# EAGLE design ledclock (EAGLE 9.5.2)
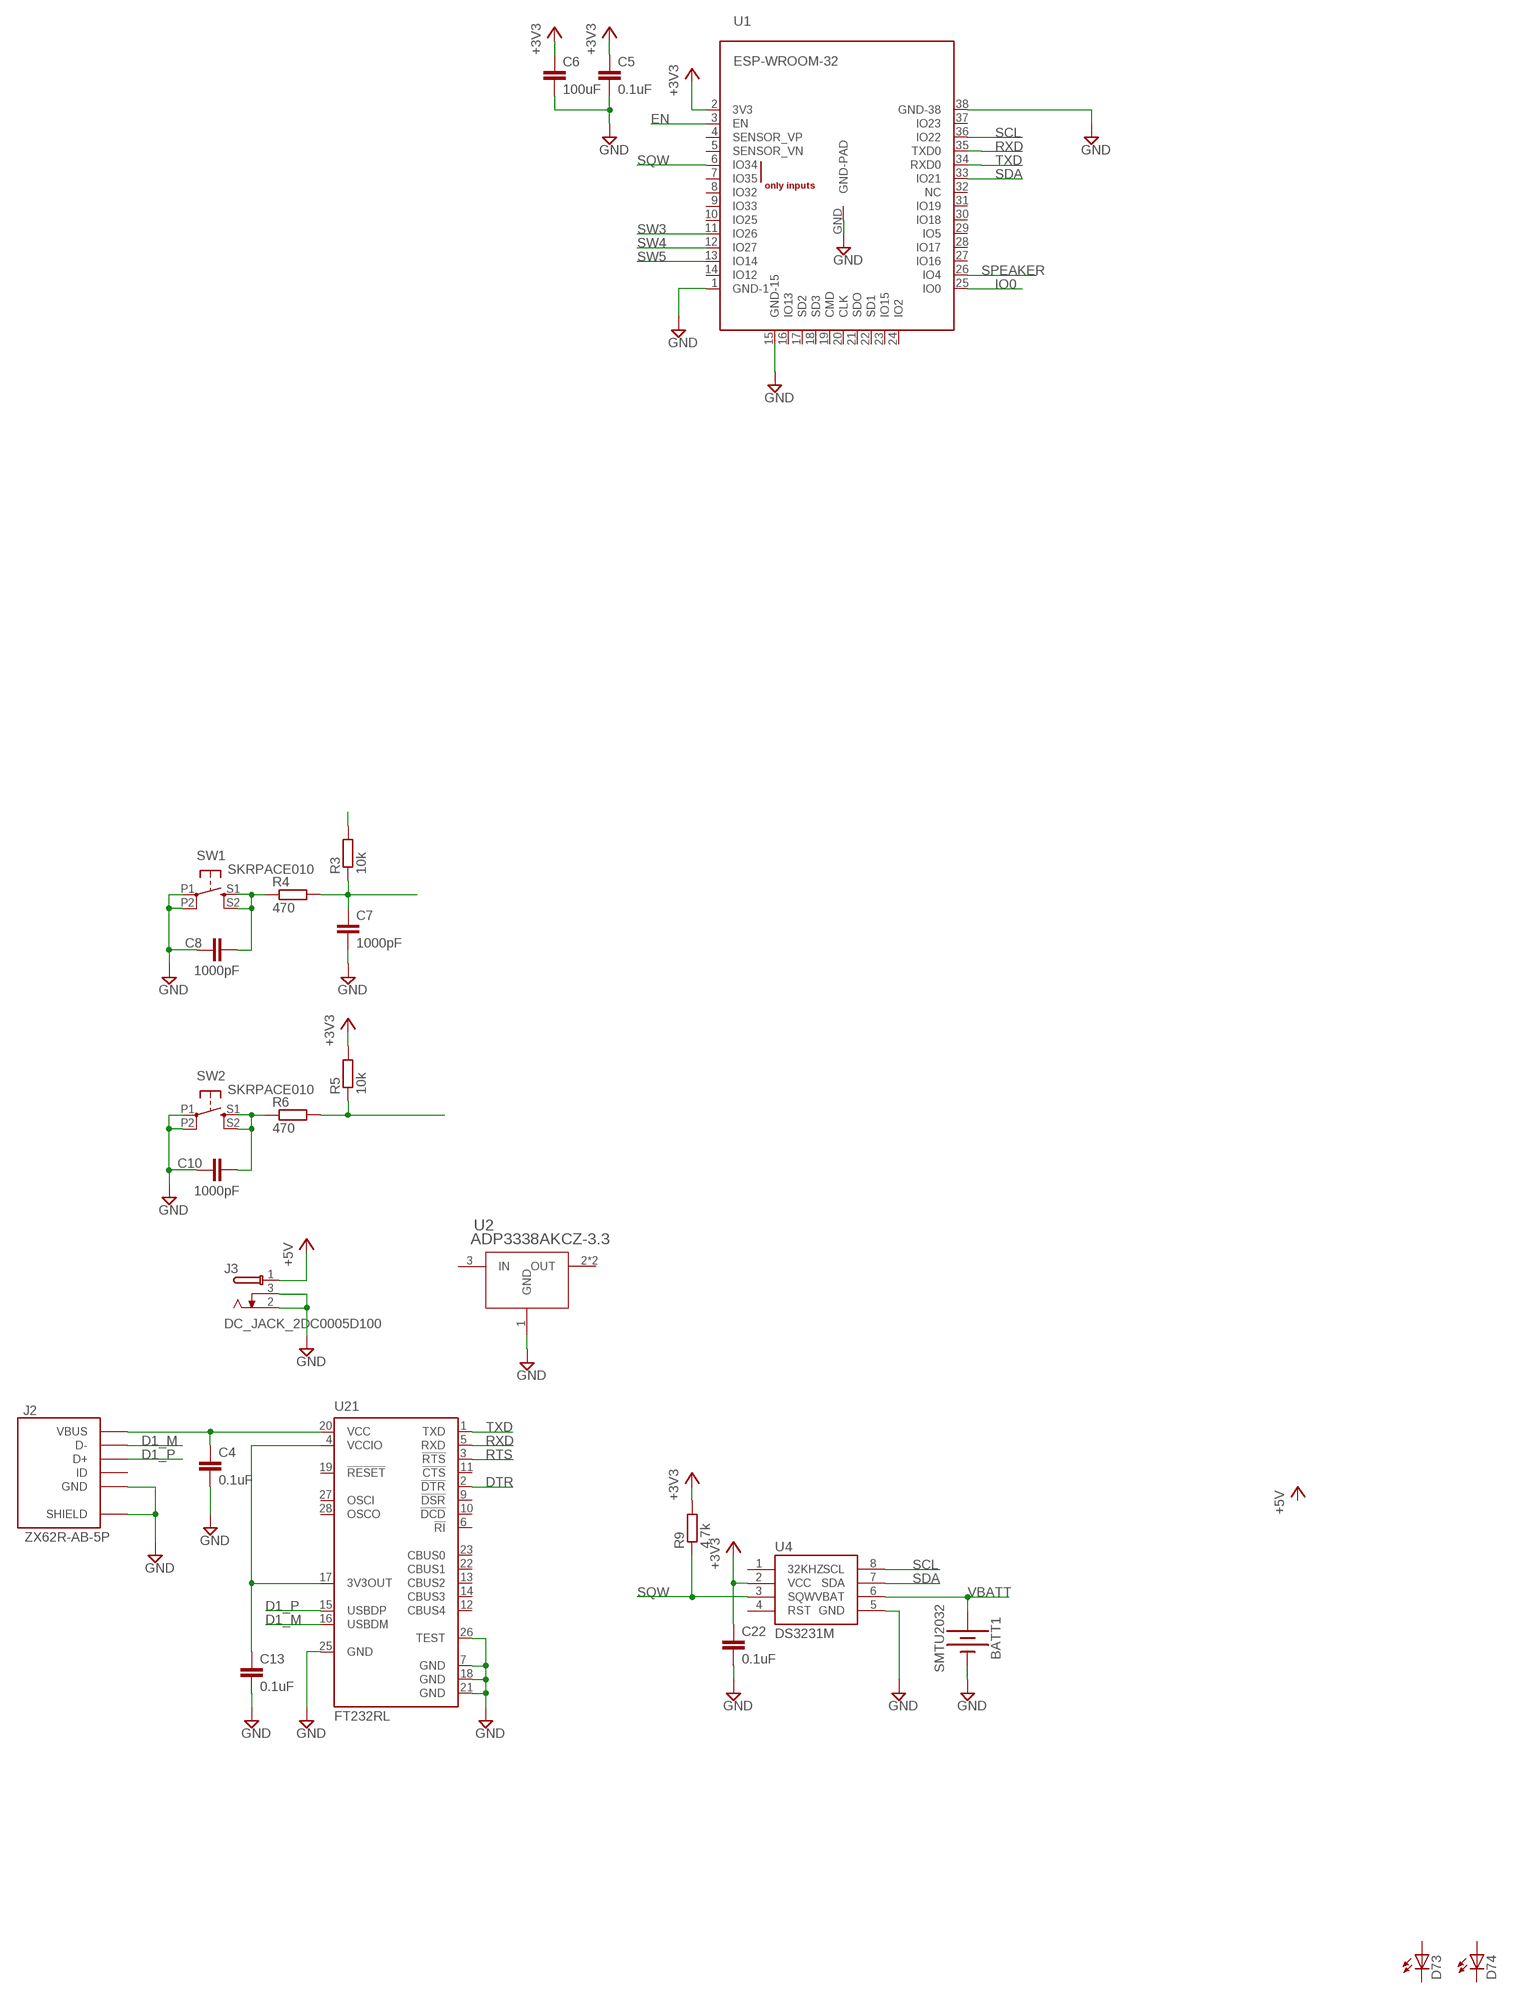
[diagram p0: schematic, sheet 1, part 1 of 2]
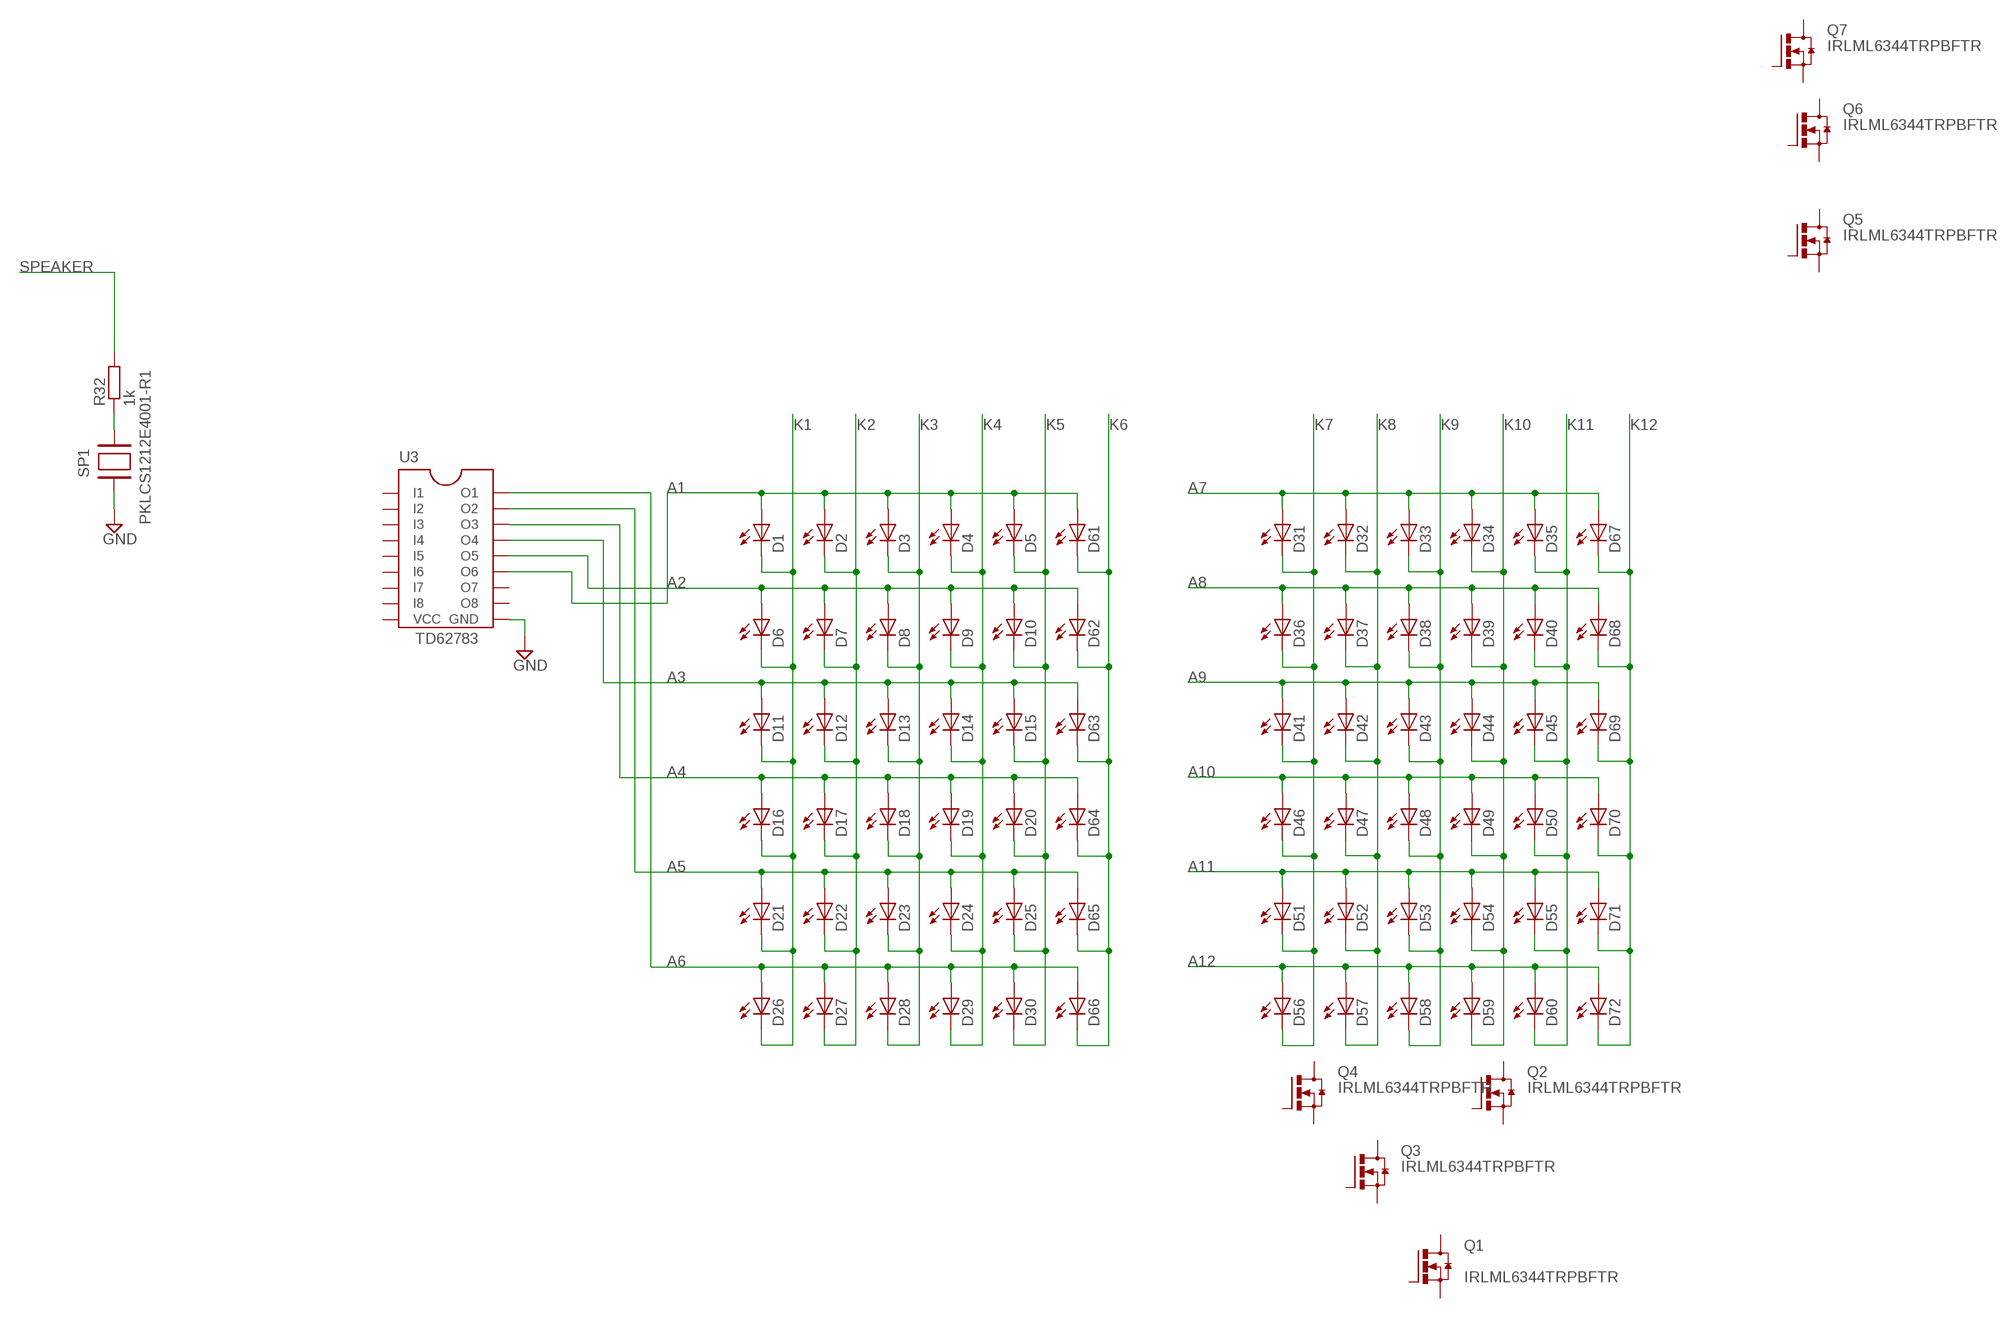
[diagram p1: schematic, sheet 1, part 2 of 2]

## Parts
BATT1  SMTU2032  [SMTU2032]
C4  0.1uF  C-EUC0603  [C0603]
C5  0.1uF  C-EUC0603  [C0603]
C6  100uF  C-EUC1210  [C1210]
C7  1000pF  C-EUC0603  [C0603]
C8  1000pF  C-EUC0603  [C0603]
C10  1000pF  C-EUC0603  [C0603]
C13  0.1uF  C-EUC0603  [C0603]
C22  0.1uF  C-EUC0603  [C0603]
D1  LED-H-0603  [CHIPLED_0603-H]
D2  LED-H-0603  [CHIPLED_0603-H]
D3  LED-H-0603  [CHIPLED_0603-H]
D4  LED-H-0603  [CHIPLED_0603-H]
D5  LED-H-0603  [CHIPLED_0603-H]
D6  LED-H-0603  [CHIPLED_0603-H]
D7  LED-H-0603  [CHIPLED_0603-H]
D8  LED-H-0603  [CHIPLED_0603-H]
D9  LED-H-0603  [CHIPLED_0603-H]
D10  LED-H-0603  [CHIPLED_0603-H]
D11  LED-H-0603  [CHIPLED_0603-H]
D12  LED-H-0603  [CHIPLED_0603-H]
D13  LED-H-0603  [CHIPLED_0603-H]
D14  LED-H-0603  [CHIPLED_0603-H]
D15  LED-H-0603  [CHIPLED_0603-H]
D16  LED-H-0603  [CHIPLED_0603-H]
D17  LED-H-0603  [CHIPLED_0603-H]
D18  LED-H-0603  [CHIPLED_0603-H]
D19  LED-H-0603  [CHIPLED_0603-H]
D20  LED-H-0603  [CHIPLED_0603-H]
D21  LED-H-0603  [CHIPLED_0603-H]
D22  LED-H-0603  [CHIPLED_0603-H]
D23  LED-H-0603  [CHIPLED_0603-H]
D24  LED-H-0603  [CHIPLED_0603-H]
D25  LED-H-0603  [CHIPLED_0603-H]
D26  LED-H-0603  [CHIPLED_0603-H]
D27  LED-H-0603  [CHIPLED_0603-H]
D28  LED-H-0603  [CHIPLED_0603-H]
D29  LED-H-0603  [CHIPLED_0603-H]
D30  LED-H-0603  [CHIPLED_0603-H]
D31  LED-H-0603  [CHIPLED_0603-H]
D32  LED-H-0603  [CHIPLED_0603-H]
D33  LED-H-0603  [CHIPLED_0603-H]
D34  LED-H-0603  [CHIPLED_0603-H]
D35  LED-H-0603  [CHIPLED_0603-H]
D36  LED-H-0603  [CHIPLED_0603-H]
D37  LED-H-0603  [CHIPLED_0603-H]
D38  LED-H-0603  [CHIPLED_0603-H]
D39  LED-H-0603  [CHIPLED_0603-H]
D40  LED-H-0603  [CHIPLED_0603-H]
D41  LED-H-0603  [CHIPLED_0603-H]
D42  LED-H-0603  [CHIPLED_0603-H]
D43  LED-H-0603  [CHIPLED_0603-H]
D44  LED-H-0603  [CHIPLED_0603-H]
D45  LED-H-0603  [CHIPLED_0603-H]
D46  LED-H-0603  [CHIPLED_0603-H]
D47  LED-H-0603  [CHIPLED_0603-H]
D48  LED-H-0603  [CHIPLED_0603-H]
D49  LED-H-0603  [CHIPLED_0603-H]
D50  LED-H-0603  [CHIPLED_0603-H]
D51  LED-H-0603  [CHIPLED_0603-H]
D52  LED-H-0603  [CHIPLED_0603-H]
D53  LED-H-0603  [CHIPLED_0603-H]
D54  LED-H-0603  [CHIPLED_0603-H]
D55  LED-H-0603  [CHIPLED_0603-H]
D56  LED-H-0603  [CHIPLED_0603-H]
D57  LED-H-0603  [CHIPLED_0603-H]
D58  LED-H-0603  [CHIPLED_0603-H]
D59  LED-H-0603  [CHIPLED_0603-H]
D60  LED-H-0603  [CHIPLED_0603-H]
D61  LED-H-0603  [CHIPLED_0603-H]
D62  LED-H-0603  [CHIPLED_0603-H]
D63  LED-H-0603  [CHIPLED_0603-H]
D64  LED-H-0603  [CHIPLED_0603-H]
D65  LED-H-0603  [CHIPLED_0603-H]
D66  LED-H-0603  [CHIPLED_0603-H]
D67  LED-H-0603  [CHIPLED_0603-H]
D68  LED-H-0603  [CHIPLED_0603-H]
D69  LED-H-0603  [CHIPLED_0603-H]
D70  LED-H-0603  [CHIPLED_0603-H]
D71  LED-H-0603  [CHIPLED_0603-H]
D72  LED-H-0603  [CHIPLED_0603-H]
D73  LED-H-0603  [CHIPLED_0603-H]
D74  LED-H-0603  [CHIPLED_0603-H]
J2  ZX62R-AB-5P  [ZX62R-B-5PA]
J3  DC_JACK_2DC0005D100  [DC_JACK_2DC0005D100]
Q1  IRLML6344TRPBFTR  [SOT23-N-MOSFET]
Q2  IRLML6344TRPBFTR  [SOT23-N-MOSFET]
Q3  IRLML6344TRPBFTR  [SOT23-N-MOSFET]
Q4  IRLML6344TRPBFTR  [SOT23-N-MOSFET]
Q5  IRLML6344TRPBFTR  [SOT23-N-MOSFET]
Q6  IRLML6344TRPBFTR  [SOT23-N-MOSFET]
Q7  IRLML6344TRPBFTR  [SOT23-N-MOSFET]
R3  10k  R-EU_R0603  [R0603]
R4  470  R-EU_R0603  [R0603]
R5  10k  R-EU_R0603  [R0603]
R6  470  R-EU_R0603  [R0603]
R9  4.7k  R-EU_R0603  [R0603]
R32  1k  R-EU_R0603  [R0603]
SP1  PKLCS1212E4001-R1  [PKLCS1212E4001-R1]
SW1  SKRPACE010  [SKRPACE010]
SW2  SKRPACE010  [SKRPACE010]
U1  ESP-WROOM-32  [ESP-WROOM-32]
U2  ADP3338AKCZ-3.3  [SOT233]
U3  TD62783  [SOP18_TOSHIBA]
U4  DS3231M  [SO08]
U21  FT232RL  [SSOP28]

## Nets
+3V3 [POWER]: C5.1 C6.1 C22.1 R3.2 R5.2 R9.2 U1.2(3V3) U4.2(VCC)
+5V: J3.1
A1: D1.A D2.A D3.A D4.A D5.A D61.A U3.13(O6)
A2: D6.A D7.A D8.A D9.A D10.A D62.A U3.14(O5)
A3: D11.A D12.A D13.A D14.A D15.A D63.A U3.15(O4)
A4: D16.A D17.A D18.A D19.A D20.A D64.A U3.16(O3)
A5: D21.A D22.A D23.A D24.A D25.A D65.A U3.17(O2)
A6: D26.A D27.A D28.A D29.A D30.A D66.A U3.18(O1)
A7: D31.A D32.A D33.A D34.A D35.A D67.A
A8: D36.A D37.A D38.A D39.A D40.A D68.A
A9: D41.A D42.A D43.A D44.A D45.A D69.A
A10: D46.A D47.A D48.A D49.A D50.A D70.A
A11: D51.A D52.A D53.A D54.A D55.A D71.A
A12: D56.A D57.A D58.A D59.A D60.A D72.A
D1_M: J2.D- U21.16(USBDM)
D1_P: J2.D+ U21.15(USBDP)
DTR: U21.2(!DTR)
EN: C7.1 R3.1 R4.2 U1.3(EN)
GND: BATT1.N(-) C4.2 C5.2 C6.2 C7.2 C8.1 C10.1 C13.2 C22.2 J2.GND J2.SHIELD@1(SHIELD) J2.SHIELD@2(SHIELD) J2.SHIELD@3(SHIELD) J2.SHIELD@4(SHIELD) J3.2 J3.3 SP1.2 SW1.P1(P) SW1.P2(P1) SW2.P1(P) SW2.P2(P1) U1.1(GND-1) U1.15(GND-15) U1.38(GND-38) U1.GND(GND-PAD) U2.1(GND) U3.10(GND) U4.5(GND) U21.7(GND) U21.18(GND) U21.21(GND) U21.25(GND) U21.26(TEST)
IO0: R5.1 R6.2 U1.25(IO0)
K1: D1.C D6.C D11.C D16.C D21.C D26.C
K2: D2.C D7.C D12.C D17.C D22.C D27.C
K3: D3.C D8.C D13.C D18.C D23.C D28.C
K4: D4.C D9.C D14.C D19.C D24.C D29.C
K5: D5.C D10.C D15.C D20.C D25.C D30.C
K6: D61.C D62.C D63.C D64.C D65.C D66.C
K7: D31.C D36.C D41.C D46.C D51.C D56.C
K8: D32.C D37.C D42.C D47.C D52.C D57.C
K9: D33.C D38.C D43.C D48.C D53.C D58.C
K10: D34.C D39.C D44.C D49.C D54.C D59.C
K11: D35.C D40.C D45.C D50.C D55.C D60.C
K12: D67.C D68.C D69.C D70.C D71.C D72.C
N$10: C8.2 R4.1 SW1.S1(S) SW1.S2(S1)
N$12: C10.2 R6.1 SW2.S1(S) SW2.S2(S1)
N$37: R32.1 SP1.1
N$84: C13.1 U21.4(VCCIO) U21.17(3V3OUT)
N$85: C4.1 J2.VCC(VBUS) U21.20(VCC)
RTS: U21.3(!RTS)
RXD: U1.35(TXD0) U21.5(RXD)
SCL: U1.36(IO22) U4.8(SCL)
SDA: U1.33(IO21) U4.7(SDA)
SPEAKER: R32.2 U1.26(IO4)
SQW: R9.1 U1.6(IO34) U4.3(SQW)
SW3: U1.11(IO26)
SW4: U1.12(IO27)
SW5: U1.13(IO14)
TXD: U1.34(RXD0) U21.1(TXD)
VBATT: BATT1.P(+) U4.6(VBAT)
Unconnected: D73.A D73.C D74.A D74.C J2.ID Q1.D Q1.G Q1.S Q2.D Q2.G Q2.S Q3.D Q3.G Q3.S Q4.D Q4.G Q4.S Q5.D Q5.G Q5.S Q6.D Q6.G Q6.S Q7.D Q7.G Q7.S U1.4(SENSOR_VP) U1.5(SENSOR_VN) U1.7(IO35) U1.8(IO32) U1.9(IO33) U1.10(IO25) U1.14(IO12) U1.16(IO13) U1.17(SD2) U1.18(SD3) U1.19(CMD) U1.20(CLK) U1.21(SDO) U1.22(SD1) U1.23(IO15) U1.24(IO2) U1.27(IO16) U1.28(IO17) U1.29(IO5) U1.30(IO18) U1.31(IO19) U1.32(NC) U1.37(IO23) U2.2(OUT) U2.3(IN) U2.4(OUT) U3.1(I1) U3.2(I2) U3.3(I3) U3.4(I4) U3.5(I5) U3.6(I6) U3.7(I7) U3.8(I8) U3.9(VCC) U3.11(O8) U3.12(O7) U4.1(32KHZ) U4.4(RST) U21.6(!RI) U21.9(!DSR) U21.10(!DCD) U21.11(!CTS) U21.12(CBUS4) U21.13(CBUS2) U21.14(CBUS3) U21.19(!RESET) U21.22(CBUS1) U21.23(CBUS0) U21.27(OSCI) U21.28(OSCO)

## Library data of the parts
BATT1 = taki-library:SMTU2032
C4-C8 C10 C13 C22 = taki-library:C-EU: CAPACITOR, European symbol
D1-D6 D9-D60 D67-D74 = taki-library:LED: LED OSRAM: - CHIPLED LG R971, LG N971, LY N971, LG Q971, LY Q971, LO R971, LY R971 LH N974, LH R974 LS Q976, LO Q976, LY Q976 LO Q996 - Hyper CHIPLED LW Q18S LB Q993, LB Q99A, LB R99A - SideLED LS A670, LO A670, LY A670, LG A670, LP A670 LB A673, LV A673, LT A673, LW A673 LH A674 LY A675 LS A676, LA A676, LO A676, LY A676, LW A676 LS A679, LY A679, LG A679 - Hyper Micro SIDELED® LS Y876, LA Y876, LO Y876, LY Y876 LT Y87S - SmartLED LW L88C, LW L88S LB L89C, LB L89S, LG L890 LS L89K, LO L89K, LY L89K LS L896, LA L896, LO L896, LY L896 - TOPLED LS T670, LO T670, LY T670, LG T670, LP T670 LSG T670, LSP T670, LSY T670, LOP T670, LYG T670 LG T671, LOG T671, LSG T671 LB T673, LV T673, LT T673, LW T673 LH T674 LS T676, LA T676, LO T676, LY T676, LB T676, LH T676, LSB T676, LW T676 LB T67C, LV T67C, LT T67C, LS T67K, LO T67K, LY T67K, LW E67C LS E67B, LA E67B, LO E67B, LY E67B, LB E67C, LV E67C, LT E67C LW T67C LS T679, LY T679, LG T679 LS T770, LO T770, LY T770, LG T770, LP T770 LB T773, LV T773, LT T773, LW T773 LH T774 LS E675, LA E675, LY E675, LS T675 LS T776, LA T776, LO T776, LY T776, LB T776 LHGB T686 LT T68C, LB T68C - Hyper Mini TOPLED® LB M676 - Mini TOPLED Santana® LG M470 LS M47K, LO M47K, LY M47K Source: http://www.osram.convergy.de LUXEON: - LUMILED® LXK2-PW12-R00, LXK2-PW12-S00, LXK2-PW14-U00, LXK2-PW14-V00 LXK2-PM12-R00, LXK2-PM12-S00, LXK2-PM14-U00 LXK2-PE12-Q00, LXK2-PE12-R00, LXK2-PE12-S00, LXK2-PE14-T00, LXK2-PE14-U00 LXK2-PB12-K00, LXK2-PB12-L00, LXK2-PB12-M00, LXK2-PB14-N00, LXK2-PB14-P00, LXK2-PB14-Q00 LXK2-PR12-L00, LXK2-PR12-M00, LXK2-PR14-Q00, LXK2-PR14-R00 LXK2-PD12-Q00, LXK2-PD12-R00, LXK2-PD12-S00 LXK2-PH12-R00, LXK2-PH12-S00 LXK2-PL12-P00, LXK2-PL12-Q00, LXK2-PL12-R00 Source: www.luxeon.com KINGBRIGHT: KA-3528ASYC Source: www.kingbright.com
D7 D8 D61-D66 = taki-library:LED: LED OSRAM: - CHIPLED LG R971, LG N971, LY N971, LG Q971, LY Q971, LO R971, LY R971 LH N974, LH R974 LS Q976, LO Q976, LY Q976 LO Q996 - Hyper CHIPLED LW Q18S LB Q993, LB Q99A, LB R99A - SideLED LS A670, LO A670, LY A670, LG A670, LP A670 LB A673, LV A673, LT A673, LW A673 LH A674 LY A675 LS A676, LA A676, LO A676, LY A676, LW A676 LS A679, LY A679, LG A679 - Hyper Micro SIDELED® LS Y876, LA Y876, LO Y876, LY Y876 LT Y87S - SmartLED LW L88C, LW L88S LB L89C, LB L89S, LG L890 LS L89K, LO L89K, LY L89K LS L896, LA L896, LO L896, LY L896 - TOPLED LS T670, LO T670, LY T670, LG T670, LP T670 LSG T670, LSP T670, LSY T670, LOP T670, LYG T670 LG T671, LOG T671, LSG T671 LB T673, LV T673, LT T673, LW T673 LH T674 LS T676, LA T676, LO T676, LY T676, LB T676, LH T676, LSB T676, LW T676 LB T67C, LV T67C, LT T67C, LS T67K, LO T67K, LY T67K, LW E67C LS E67B, LA E67B, LO E67B, LY E67B, LB E67C, LV E67C, LT E67C LW T67C LS T679, LY T679, LG T679 LS T770, LO T770, LY T770, LG T770, LP T770 LB T773, LV T773, LT T773, LW T773 LH T774 LS E675, LA E675, LY E675, LS T675 LS T776, LA T776, LO T776, LY T776, LB T776 LHGB T686 LT T68C, LB T68C - Hyper Mini TOPLED® LB M676 - Mini TOPLED Santana® LG M470 LS M47K, LO M47K, LY M47K Source: http://www.osram.convergy.de LUXEON: - LUMILED® LXK2-PW12-R00, LXK2-PW12-S00, LXK2-PW14-U00, LXK2-PW14-V00 LXK2-PM12-R00, LXK2-PM12-S00, LXK2-PM14-U00 LXK2-PE12-Q00, LXK2-PE12-R00, LXK2-PE12-S00, LXK2-PE14-T00, LXK2-PE14-U00 LXK2-PB12-K00, LXK2-PB12-L00, LXK2-PB12-M00, LXK2-PB14-N00, LXK2-PB14-P00, LXK2-PB14-Q00 LXK2-PR12-L00, LXK2-PR12-M00, LXK2-PR14-Q00, LXK2-PR14-R00 LXK2-PD12-Q00, LXK2-PD12-R00, LXK2-PD12-S00 LXK2-PH12-R00, LXK2-PH12-S00 LXK2-PL12-P00, LXK2-PL12-Q00, LXK2-PL12-R00 Source: www.luxeon.com KINGBRIGHT: KA-3528ASYC Source: www.kingbright.com; SPICEPREFIX: D
J2 = taki-library:ZX62
J3 = taki-library:DC_JACK_2DC0005D100: AKIZUKIDENSHI 2DC-0005D100 SINGATRON ENTERPRISE CO., LTD http://akizukidenshi.com/download/2DC-0005D100.pdf
Q1-Q7 = taki-library:IRLML6344TRPBFTR
R3-R6 R9 R32 = taki-library:R-EU_: RESISTOR, European symbol
SP1 = taki-library:PKLCS1212E4001-R1
SW1 SW2 = taki-library:SKRPACE010
U1 = taki-library:ESP-WROOM-32
U2 = taki-library:ADP3338AKCZ-3.3
U3 = taki-library:TD62783: 8ch Darlington Sink Driver Source: http://akizukidenshi.com/download/TD62083AP.pdf
U4 = taki-library:DS3231M: DS3231M Real Time Clock Accuracy +/-5ppm. Battery Backup. 2.3V to 5.5V. Datasheet <https://cdn.sparkfun.com/datasheets/Dev/Beagle/DS3231M.pdf> SparkFun Products CryptoCape <https://www.sparkfun.com/products/12773> (DEV-12773) SparkFun CryptoShield <https://www.sparkfun.com/products/13183> (DEV-13183); PROD_ID: IC-11985
U21 = taki-library:FT232R: Source: http://www.ftdichip.com/Documents/DataSheets/DS_FT232R_v104.pdf; MPN: FT232RL; OC_FARNELL: 1146032; OC_NEWARK: 91K9918

## Net classes
0 default: width 0.152 mm
1 POWER: width 0.152 mm

## Board
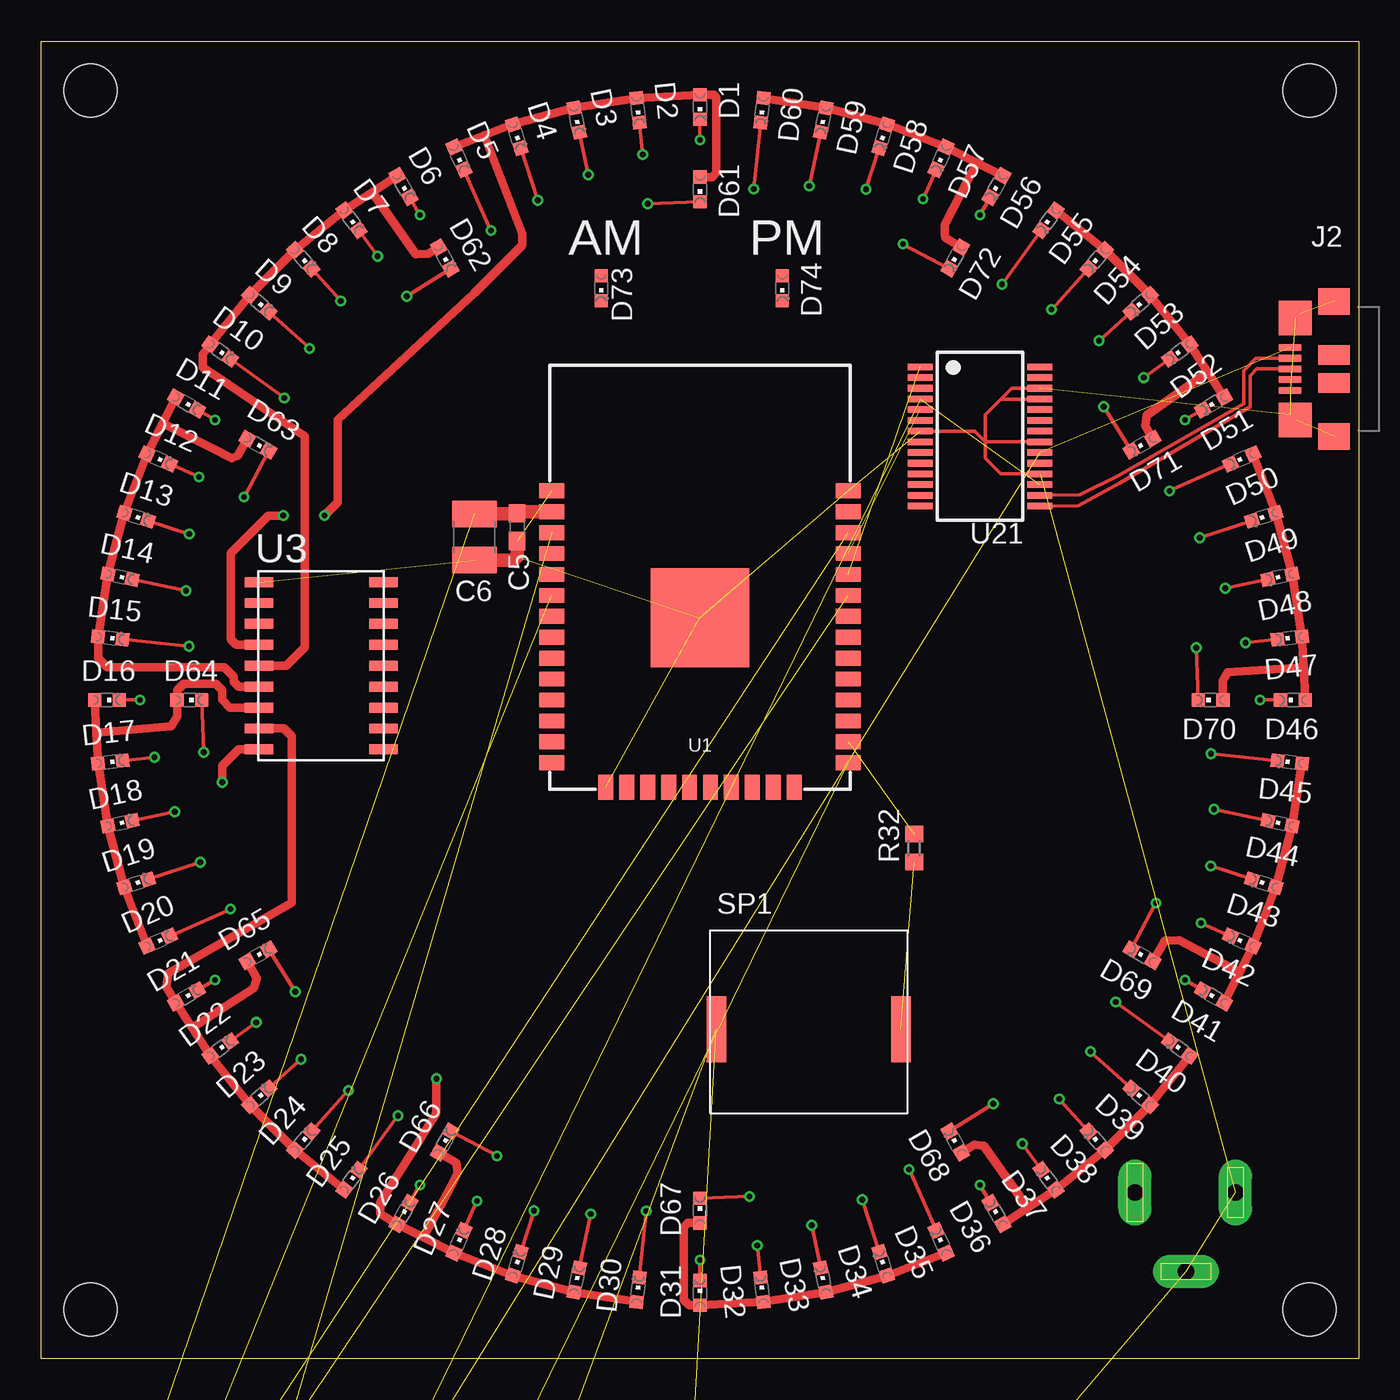
[diagram p2: board, top side]
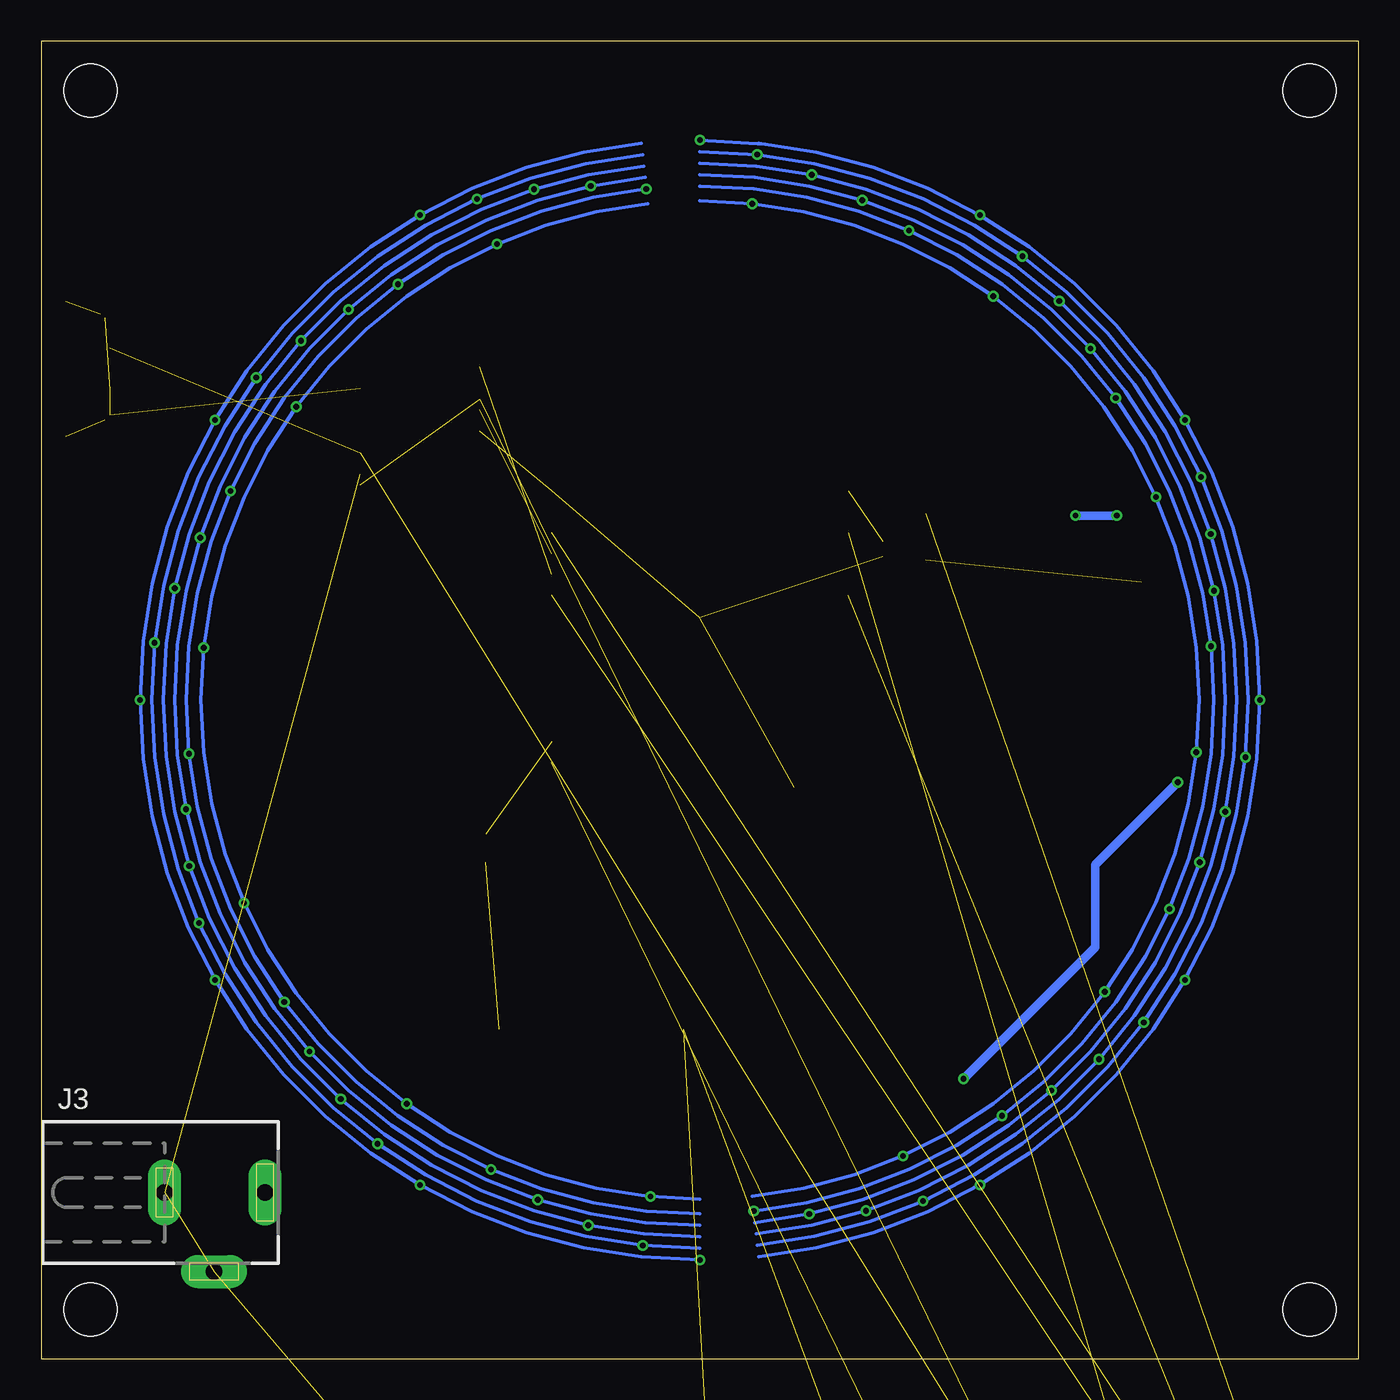
[diagram p3: board, bottom side, seen from below]

Size 80 x 80 mm. Coordinates in mm from the lower left corner, seen from the top.
Outline: 80,80 80,0 0,0 0,80 80,80
Copper layers (1*16): Top 0.035mm / dielectric 1.6mm / Bottom 0.035mm
Design rules "Elecrow_2-layer_PCB_eagle_rule": minimum track width 6mil, minimum drill 12mil, track to track 6mil, track to pad 6mil, pad to pad 6mil, via to via 8mil, smd to smd 0mil, copper to edge 20mil, drill to drill 10mil, minimum pad ring 6mil, minimum via ring 6mil, stop-mask expansion 0mil, vias tented up to drill 100mil, thermal gap 10mil
Holes 3.2 mm at 3,77 77,77 77,3 3,3

### Footprints (pad centres in the part's own frame; a part is rotated, then mirrored left to right if it is on the bottom)
SMTU2032 = smd 2.6 x 3.5: N 14.7,0; P -14.7,0
C0603 = smd 1.1 x 1: 1 -0.85,0; 2 0.85,0
C1210 = smd 1.6 x 2.7: 1 -1.4,0; 2 1.4,0
CHIPLED_0603-H = smd 0.8 x 0.8: A 0.75,0; C -0.75,0
ZX62R-B-5PA = smd 0.4 x 1.35: D+ 0,2.675; D- 0.65,2.675; GND -1.3,2.675; ID -0.65,2.675; VCC 1.3,2.675 | smd 1.2 x 1.9: NC@1 -0.85,0; NC@2 0.85,0 | smd 2.1 x 2: SHIELD@1 -3.1,2.35; SHIELD@2 3.1,2.35 | smd 1.6 x 1.9: SHIELD@3 -4.1,0; SHIELD@4 4.1,0
DC_JACK_2DC0005D100 = drill 1 pad 2 long: 1 -3.1,0; 2 3,0; 3 0,4.8
SOT23-N-MOSFET = smd 0.8 x 0.9: D 0,1; G -0.95,-1; S 0.95,-1
R0603 = smd 1 x 1.1: 1 -0.85,0; 2 0.85,0
PKLCS1212E4001-R1 = smd 1.2 x 4: 1 11.2,0; 2 0,0
SKRPACE010 = smd 1.05 x 0.65: P1 -2.075,-1.075; P2 2.075,-1.075; S1 -2.075,1.075; S2 2.075,1.075
ESP-WROOM-32 = smd 0.9 x 1.5: 1 7.7,9; 2 6.43,9; 3 5.16,9; 4 3.89,9; 5 2.62,9; 6 1.35,9; 7 0.08,9; 8 -1.19,9; 9 -2.46,9; 10 -3.73,9; 11 -5,9; 12 -6.27,9; 13 -7.54,9; 14 -8.81,9; 25 -8.81,-9; 26 -7.54,-9; 27 -6.27,-9; 28 -5,-9; 29 -3.73,-9; 30 -2.46,-9; 31 -1.19,-9; 32 0.08,-9; 33 1.35,-9; 34 2.62,-9; 35 3.89,-9; 36 5.16,-9; 37 6.43,-9; 38 7.7,-9 | smd 1.5 x 0.9: 15 -10.3,5.715; 16 -10.3,4.445; 17 -10.3,3.175; 18 -10.3,1.905; 19 -10.3,0.635; 20 -10.3,-0.635; 21 -10.3,-1.905; 22 -10.3,-3.175; 23 -10.3,-4.445; 24 -10.3,-5.715 | smd 6 x 6: GND 0,0
SOT233 = smd 1.75 x 0.95: 1 -3.15,2.3; 2 -3.15,0; 3 -3.15,-2.3 | smd 1.75 x 3.2: 4 3.15,0
SOP18_TOSHIBA = smd 0.6 x 1.725: 1 0,-3.775; 2 1.27,-3.775; 3 2.54,-3.775; 4 3.81,-3.775; 5 5.08,-3.775; 6 6.35,-3.775; 7 7.62,-3.775; 8 8.89,-3.775; 9 10.16,-3.775; 10 10.16,3.775; 11 8.89,3.775; 12 7.62,3.775; 13 6.35,3.775; 14 5.08,3.775; 15 3.81,3.775; 16 2.54,3.775; 17 1.27,3.775; 18 0,3.775
SO08 = smd 0.6 x 1.2: 1 -1.905,-2.8; 2 -0.635,-2.8; 3 0.635,-2.8; 4 1.905,-2.8; 5 1.905,2.8; 6 0.635,2.8; 7 -0.635,2.8; 8 -1.905,2.8
SSOP28 = smd 0.4 x 1.5: 1 -4.225,-3.625; 2 -3.575,-3.625; 3 -2.925,-3.625; 4 -2.275,-3.625; 5 -1.625,-3.625; 6 -0.975,-3.625; 7 -0.325,-3.625; 8 0.325,-3.625; 9 0.975,-3.625; 10 1.625,-3.625; 11 2.275,-3.625; 12 2.925,-3.625; 13 3.575,-3.625; 14 4.225,-3.625; 15 4.225,3.625; 16 3.575,3.625; 17 2.925,3.625; 18 2.275,3.625; 19 1.625,3.625; 20 0.975,3.625; 21 0.325,3.625; 22 -0.325,3.625; 23 -0.975,3.625; 24 -1.625,3.625; 25 -2.275,3.625; 26 -2.925,3.625; 27 -3.575,3.625; 28 -4.225,3.625

### Placement (x,y rotation side)
BATT1  29,-25 0 top  (outside the outline)
C4  -8,-57 0 top  (outside the outline)
C5  28.9,50.5 270 top
C6  26.3,49.9 270 top
C7  -8,-85 0 top  (outside the outline)
C8  0,-85 0 top  (outside the outline)
C10  36,-83 0 top  (outside the outline)
C13  -2,-57 0 top  (outside the outline)
C22  4,-57 0 top  (outside the outline)
D1  40,76 90 top
D2  36.24,75.8 96 top
D3  32.52,75.21 102 top
D4  28.88,74.24 108 top
D5  25.36,72.89 114 top
D6  22,71.18 120 top
D7  18.84,69.12 126 top
D8  15.91,66.75 132 top
D9  13.25,64.09 138 top
D10  10.88,61.16 144 top
D11  8.82,58 150 top
D12  7.11,54.64 156 top
D13  5.76,51.12 162 top
D14  4.79,47.48 168 top
D15  4.2,43.76 174 top
D16  4,40 180 top
D17  4.2,36.24 186 top
D18  4.79,32.52 192 top
D19  5.76,28.88 198 top
D20  7.11,25.36 204 top
D21  8.82,22 210 top
D22  10.88,18.84 216 top
D23  13.25,15.91 222 top
D24  15.91,13.25 228 top
D25  18.84,10.88 234 top
D26  22,8.82 240 top
D27  25.36,7.11 246 top
D28  28.88,5.76 252 top
D29  32.52,4.79 258 top
D30  36.24,4.2 264 top
D31  40,4 270 top
D32  43.76,4.2 276 top
D33  47.48,4.79 282 top
D34  51.12,5.76 288 top
D35  54.64,7.11 294 top
D36  58,8.82 300 top
D37  61.16,10.88 306 top
D38  64.09,13.25 312 top
D39  66.75,15.91 318 top
D40  69.12,18.84 324 top
D41  71.18,22 330 top
D42  72.89,25.36 336 top
D43  74.24,28.88 342 top
D44  75.21,32.52 348 top
D45  75.8,36.24 354 top
D46  76,40 0 top
D47  75.8,43.76 6 top
D48  75.21,47.48 12 top
D49  74.24,51.12 18 top
D50  72.89,54.64 24 top
D51  71.18,58 30 top
D52  69.12,61.16 36 top
D53  66.75,64.09 42 top
D54  64.09,66.75 48 top
D55  61.16,69.12 54 top
D56  58,71.18 60 top
D57  54.64,72.89 66 top
D58  51.12,74.24 72 top
D59  47.48,75.21 78 top
D60  43.76,75.8 84 top
D61  40,71 90 top
D62  24.5,66.85 120 top
D63  13.15,55.5 150 top
D64  9,40 180 top
D65  13.15,24.5 210 top
D66  24.5,13.15 240 top
D67  40,9 270 top
D68  55.5,13.15 300 top
D69  66.85,24.5 330 top
D70  71,40 0 top
D71  66.85,55.5 30 top
D72  55.5,66.85 60 top
D73  34,65 90 top
D74  45,65 90 top
J2  78.5,60.1 90 top
J3  69.5,10.1 180 bottom
Q1  -26,-154 0 top  (outside the outline)
Q2  -26,-161 0 top  (outside the outline)
Q3  -26,-168 0 top  (outside the outline)
Q4  -26,-175 0 top  (outside the outline)
Q5  -26,-182 0 top  (outside the outline)
Q6  -26,-189 0 top  (outside the outline)
Q7  -26,-196 0 top  (outside the outline)
R3  -3,-79 0 top  (outside the outline)
R4  5,-71 0 top  (outside the outline)
R5  1,-79 0 top  (outside the outline)
R6  -8,-79 0 top  (outside the outline)
R9  11,-50 0 top  (outside the outline)
R32  53,31 90 top
SP1  41,20 0 top
SW1  -6,-64 0 top  (outside the outline)
SW2  -6,-72 0 top  (outside the outline)
U1  40,45 90 top
U2  -34,-193 0 top  (outside the outline)
U3  17,37 90 top
U4  -5,-38 0 top  (outside the outline)
U21  57,56 270 top

### Tracks (layer width: path | path; a pad name or v marks a point on that pad's centre or on a via)
+3V3  (5 unrouted)
  Top 0.813: C6.1 28.85,51.3 C5.1 28.98,51.43 U1.2
A1  (via drill 0.35)
  Top 0.508: 26.89,74.28 D4.A D3.A D2.A D1.A 40.85,76.75 41,76.6 41,72 40.75,71.75 D61.A | 26.89,74.28 D5.A | U3.13 11.85,43.35 11.5,43.7 11.5,48.9 13.8,51.2 v14.7,51.2 | 26.89,74.28 29.2,68.3 29.2,67.6 26.3,64.7 18,57 18,52 v17.2,51.2
  Bottom 0.508: v14.7,51.2 v17.2,51.2
A2
  Top 0.508: D6.A 20.11,70.84 | 20.11,70.84 D7.A D8.A D9.A D10.A 9.8,61 9.8,60.2 10.03,60.05 10.6,59.7 16,56 16,43.2 14.88,42.08 U3.14 | D62.A 23.5,67.09 22.73,67.06 20.11,70.84
A3
  Top 0.508: D11.A 7.38,56.81 | 7.38,56.81 D12.A D13.A D14.A D15.A 3.45,42.55 4,42 11.1,42 11.7,41.4 11.7,41.1 11.99,40.81 U3.15 | 7.38,56.81 10.46,55.24 11.57,54.68 11.93,54.83 D63.A
A4
  Top 0.508: D16.A 3.35,38.02 | 3.35,38.02 D17.A D18.A D19.A D20.A | U3.16 11.46,39.54 11,40 11,40.6 10.6,41 8.65,41 8.25,40.6 D64.A 8.25,39 7.9,38.42 3.35,38.02
A5
  Top 0.508: 9.16,20.11 D21.A 7.6,22.6 7.7,23.4 14,27 15.2,27.7 15.2,37.8 14.73,38.27 U3.17 | 9.16,20.11 D22.A D23.A D24.A D25.A | 9.16,20.11 12.9,22.5 13.1,23.1 D65.A
A6  (via drill 0.35)
  Top 0.508: 23.19,7.38 D26.A 20.6,8.8 20.6,9.5 22.5,12.5 24,14.9 v24,17 | 23.19,7.38 D27.A D28.A D29.A D30.A | U3.18 12,37 11,36 v11,35 | 23.19,7.38 24.4,9.6 24.9,10.5 25.3,11.3 25.2,11.9 D66.A
  Bottom 0.508: v11,35 16,30 16,25 v24,17
A7
  Top 0.508: D35.A D34.A D33.A D32.A D31.A 39.35,3.25 39,3.6 39,8 39.25,8.25 D67.A
A8
  Top 0.508: D36.A 59.89,9.16 | 59.89,9.16 D37.A D38.A D39.A D40.A | D68.A 56.65,13 57.23,12.95 59.89,9.16
A9
  Top 0.508: D41.A 72.62,23.19 72.76,23.46 | 72.76,23.46 D42.A D43.A D44.A D45.A | D69.A 67.95,24.9 68.21,25.38 69.1,25.42 72.76,23.46
A10
  Top 0.508: D46.A 76.65,41.98 | 76.65,41.98 D47.A D48.A D49.A D50.A | D70.A 71.74,40.73 71.73,41.17 72.05,41.67 76.65,41.98
A11
  Top 0.508: D51.A 70.84,59.89 | 70.84,59.89 D52.A D53.A D54.A D55.A | D71.A 67.02,56.66 67.11,57.29 70.84,59.89
A12
  Top 0.508: D56.A 57.21,72.42 56.81,72.62 | 56.81,72.62 D57.A D58.A D59.A D60.A | 56.81,72.62 54.87,68.84 54.85,68.35 54.9,68.05 D72.A
D1_M
  Top 0.203: J2.D- 73.75,60.75 73,60 73,58 65.4,53.6 63.07,52.47 U21.16
D1_P
  Top 0.203: J2.D+ 73.8,60.1 73.4,59.7 73.4,57.82 65.5,53.2 62.95,51.78 U21.15
EN  (3 unrouted)
GND  (27 unrouted)
  Top 0.203: U21.7 56.67,56.33 57.33,55.67 | 57.33,55.67 U21.21 | U21.25 58.27,58.27 | 57.33,55.67 57.33,57.33 58.27,58.27 | U21.26 58.92,58.92 58.27,58.27 | 57.33,55.67 57.33,54.67 58.27,53.73 U21.18 60.65,53.7 | J2.SHIELD@2 76.4,63.45 | J2.SHIELD@1 75.83,57.33
  Top 0.813: C6.2 28.7,48.5 28.9,48.7 C5.2
IO0  (2 unrouted)
K1  (via drill 0.35)
  Top 0.203: D26.C v23,10.55 | D1.C v40,74 | v10.55,23 D21.C | v6,40 D16.C | v10.55,57 D11.C | v23,69.44 D6.C
  Bottom 0.203: 36.45,73.81 36.04,73.75 | 36.04,73.75 32.93,73.26 29.49,72.34 26.17,71.06 v23,69.44 20.02,67.51 17.25,65.27 14.73,62.75 12.49,59.98 v10.55,57 8.94,53.83 7.66,50.51 6.74,47.07 6.19,43.55 v6,40 6.19,36.45 6.74,32.93 7.66,29.49 8.94,26.17 v10.55,23 12.49,20.02 14.73,17.25 17.25,14.73 20.02,12.49 v23,10.55 26.17,8.94 29.49,7.66 32.93,6.74 36.04,6.25 36.45,6.19 | 36.04,73.75 v40,74
K2  (via drill 0.35)
  Top 0.203: D27.C v26.46,9.58 | D2.C v36.52,73.12 | v13.06,20.43 D22.C | v6.88,36.52 D17.C | v9.58,53.54 D12.C | v20.43,66.94 D7.C
  Bottom 0.203: 36.52,6.88 33.08,7.43 29.71,8.33 v26.46,9.58 23.35,11.16 20.43,13.06 17.72,15.25 15.25,17.72 v13.06,20.43 11.16,23.35 9.58,26.46 8.33,29.71 7.43,33.08 v6.88,36.52 6.7,40 6.88,43.48 7.43,46.92 8.33,50.29 v9.58,53.54 11.16,56.65 13.06,59.57 15.25,62.28 17.72,64.75 v20.43,66.94 23.35,68.84 26.46,70.42 29.71,71.67 33.08,72.57 v36.52,73.12 40.02,73.3 40,73.3
K3  (via drill 0.35)
  Top 0.203: D28.C v29.93,9 | D3.C v33.22,71.89 | v15.77,18.19 D23.C | v8.11,33.22 D18.C | v9,50.07 D13.C | v18.19,64.23 D8.C
  Bottom 0.203: 36.59,7.58 33.22,8.11 v29.93,9 26.74,10.22 23.7,11.77 20.84,13.63 18.19,15.77 v15.77,18.19 13.63,20.84 11.77,23.7 10.22,26.74 9,29.93 v8.11,33.22 7.58,36.59 7.4,40 7.58,43.41 8.11,46.78 v9,50.07 10.22,53.26 11.77,56.3 13.63,59.16 15.77,61.81 v18.19,64.23 20.84,66.37 23.7,68.23 26.74,69.78 29.93,71 v33.22,71.89 36.59,72.42 40,72.6
K4  (via drill 0.35)
  Top 0.203: D29.C v33.37,8.8 | D4.C v30.14,70.34 | v18.66,16.29 D24.C | v9.66,30.14 D19.C | v8.8,46.63 D14.C | v16.29,61.34 D9.C
  Bottom 0.203: 36.67,8.27 v33.37,8.8 30.14,9.66 27.02,10.86 24.05,12.37 21.25,14.19 v18.66,16.29 16.29,18.66 14.19,21.25 12.37,24.05 10.86,27.02 v9.66,30.14 8.8,33.37 8.27,36.67 8.1,40 8.27,43.33 v8.8,46.63 9.66,49.86 10.86,52.98 12.37,55.95 14.19,58.75 v16.29,61.34 18.66,63.71 21.25,65.81 24.05,67.63 27.02,69.14 v30.14,70.34 33.37,71.2 36.67,71.72 40,71.9
K5  (via drill 0.35)
  Top 0.203: D30.C v36.74,8.97 | D5.C v27.31,68.5 | v21.66,14.76 D25.C | v11.5,27.31 D20.C | v8.97,43.26 D15.C | v14.76,58.34 D10.C
  Bottom 0.203: 40,71.2 39.99,71.2 | 39.99,71.2 | v36.74,8.97 33.51,9.48 30.36,10.33 27.31,11.5 24.4,12.98 v21.66,14.76 19.12,16.81 16.81,19.12 14.76,21.66 12.98,24.4 v11.5,27.31 10.33,30.36 9.48,33.51 8.97,36.74 8.8,40 v8.97,43.26 9.48,46.49 10.33,49.64 11.5,52.69 12.98,55.6 v14.76,58.34 16.81,60.88 19.12,63.19 21.66,65.24 24.4,67.02 v27.31,68.5 30.36,69.67 33.51,70.52 36.74,71.03 40.01,71.2 39.99,71.2
K6  (via drill 0.35)
  Top 0.203: D66.C v27.68,12.32 | D64.C v9.87,36.83 | D63.C v12.32,52.32 | v22.19,64.51 D62.C | v36.83,70.13 D61.C | D65.C v15.43,22.28
  Bottom 0.203: 36.83,9.87 33.7,10.36 30.64,11.18 v27.68,12.32 24.85,13.76 22.19,15.49 19.73,17.48 17.48,19.73 15.49,22.19 v15.43,22.28 13.76,24.85 12.32,27.68 11.18,30.64 10.36,33.7 v9.87,36.83 9.7,40 9.87,43.17 10.36,46.3 11.18,49.36 v12.32,52.32 13.76,55.15 15.49,57.81 17.48,60.27 19.73,62.52 v22.19,64.51 24.85,66.24 27.68,67.68 30.64,68.82 33.7,69.64 v36.83,70.13 40.02,70.3 40,70.3
K7  (via drill 0.35)
  Top 0.203: D31.C v40,6 | D36.C v57,10.55 | D41.C v69.44,23 | D46.C v74,40 | D51.C v69.44,57 | D56.C v57,69.44
  Bottom 0.203: 43.55,73.81 47.07,73.26 50.51,72.34 53.83,71.06 v57,69.44 59.98,67.51 62.75,65.27 65.27,62.75 67.51,59.98 v69.44,57 71.06,53.83 72.34,50.51 73.26,47.07 73.81,43.55 v74,40 73.81,36.45 73.26,32.93 72.34,29.49 71.06,26.17 v69.44,23 67.51,20.02 65.27,17.25 62.75,14.73 59.98,12.49 v57,10.55 53.83,8.94 50.51,7.66 47.07,6.74 43.55,6.19 v40,6
K8  (via drill 0.35)
  Top 0.203: D32.C v43.48,6.88 | D37.C v59.57,13.06 | D42.C v70.42,26.46 | D47.C v73.12,43.48 | D52.C v66.94,59.57 | D57.C v53.54,70.42
  Bottom 0.203: 43.48,73.12 46.92,72.57 50.29,71.67 v53.54,70.42 56.65,68.84 59.57,66.94 62.28,64.75 64.75,62.28 v66.94,59.57 68.84,56.65 70.42,53.54 71.67,50.29 72.57,46.92 v73.12,43.48 73.3,40 73.12,36.52 72.57,33.08 71.67,29.71 v70.42,26.46 68.84,23.35 66.94,20.43 64.75,17.72 62.28,15.25 v59.57,13.06 56.65,11.16 53.54,9.58 50.29,8.33 46.92,7.43 v43.48,6.88 40,6.7
K9  (via drill 0.35)
  Top 0.203: D33.C v46.78,8.11 | D38.C v61.81,15.77 | D43.C v71,29.93 | D48.C v71.89,46.78 | D53.C v64.23,61.81 | D58.C v50.07,71
  Bottom 0.203: 43.41,72.42 46.78,71.89 v50.07,71 53.26,69.78 56.3,68.23 59.16,66.37 61.81,64.23 v64.23,61.81 66.37,59.16 68.23,56.3 69.78,53.26 71,50.07 v71.89,46.78 72.42,43.41 72.6,40 72.42,36.59 71.89,33.22 v71,29.93 69.78,26.74 68.23,23.7 66.37,20.84 64.23,18.19 v61.81,15.77 59.16,13.63 56.3,11.77 53.26,10.22 50.07,9 v46.78,8.11 43.41,7.58 40,7.4
K10  (via drill 0.35)
  Top 0.203: D34.C v49.86,9.66 | D39.C v63.71,18.66 | D44.C v71.2,33.37 | D49.C v70.34,49.86 | D54.C v61.34,63.71 | D59.C v46.63,71.2
  Bottom 0.203: 43.33,71.72 v46.63,71.2 49.86,70.34 52.98,69.14 55.95,67.63 58.75,65.81 v61.34,63.71 63.71,61.34 65.81,58.75 67.63,55.95 69.14,52.98 v70.34,49.86 71.2,46.63 71.72,43.33 71.9,40 71.72,36.67 v71.2,33.37 70.34,30.14 69.14,27.02 67.63,24.05 65.81,21.25 v63.71,18.66 61.34,16.29 58.75,14.19 55.95,12.37 52.98,10.86 v49.86,9.66 46.63,8.8 43.33,8.27 40,8.1
K11  (via drill 0.35)
  Top 0.203: D35.C v52.69,11.5 | D40.C v65.24,21.66 | D45.C v71.03,36.74 | D50.C v68.5,52.69 | D60.C v43.26,71.03 | D55.C v58.34,65.24
  Bottom 0.203: v43.26,71.03 46.49,70.52 49.64,69.67 52.69,68.5 55.6,67.02 v58.34,65.24 60.88,63.19 63.19,60.88 65.24,58.34 67.02,55.6 v68.5,52.69 69.67,49.64 70.52,46.49 71.03,43.26 71.2,40 v71.03,36.74 70.52,33.51 69.67,30.36 68.5,27.31 67.02,24.4 v65.24,21.66 63.19,19.12 60.88,16.81 58.34,14.76 55.6,12.98 v52.69,11.5 49.64,10.33 46.49,9.48 43.26,8.97 40,8.8
K12  (via drill 0.35)
  Top 0.203: D67.C v43.01,9.86 | D68.C v57.81,15.49 | D69.C v67.68,27.68 | D70.C v70.13,43.17 | D71.C v64.51,57.81 | D72.C v52.32,67.68
  Bottom 0.203: 43.17,70.13 46.3,69.64 49.36,68.82 v52.32,67.68 55.15,66.24 57.81,64.51 60.27,62.52 62.52,60.27 v64.51,57.81 66.24,55.15 67.68,52.32 68.82,49.36 69.64,46.3 v70.13,43.17 70.3,40 70.13,36.83 69.64,33.7 68.82,30.64 v67.68,27.68 66.24,24.85 64.51,22.19 62.52,19.73 60.27,17.48 v57.81,15.49 55.15,13.76 52.32,12.32 49.36,11.18 46.3,10.36 43.17,9.87 v43.01,9.86 40.02,9.7 40,9.7
N$10  (3 unrouted)
N$12  (3 unrouted)
N$37  (1 unrouted)
N$84  (2 unrouted)
N$85  (2 unrouted)
RXD  (1 unrouted)
SCL  (1 unrouted)
SDA  (1 unrouted)
SPEAKER  (1 unrouted)
SQW  (2 unrouted)
TXD  (1 unrouted)
VBATT  (1 unrouted)

### Text on the board
tPlace: AM | PM